# EAGLE design detcord-mdrv (EAGLE 7.6.0)
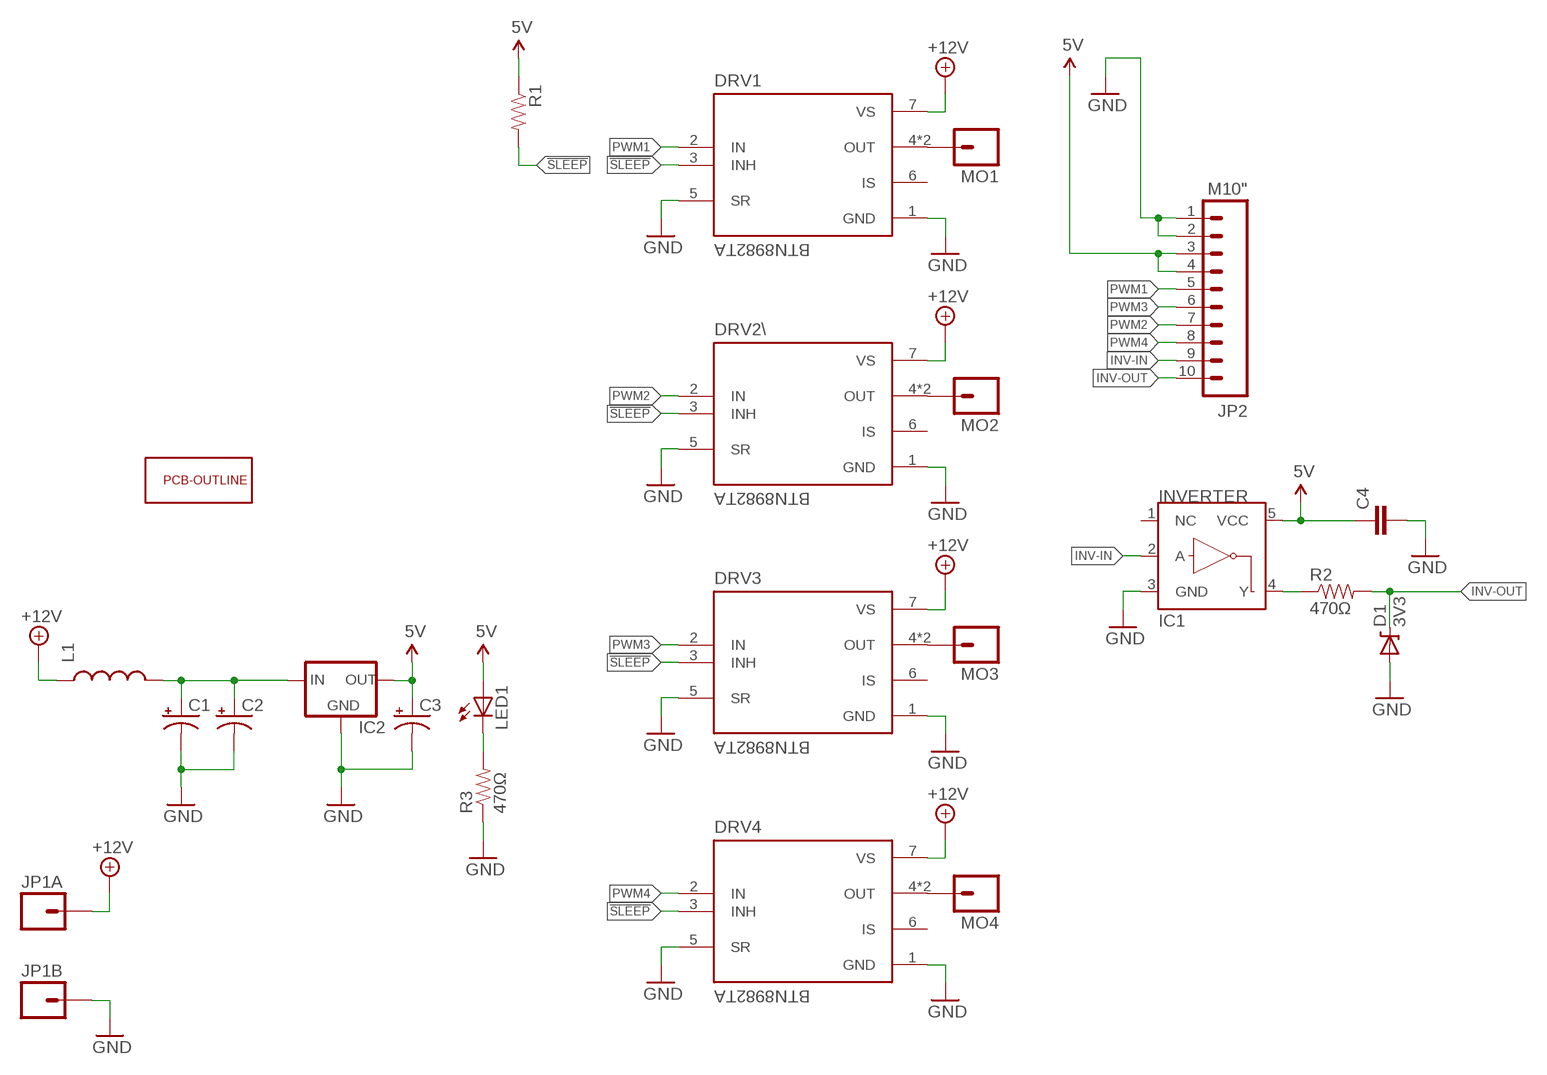
[diagram p0: schematic, sheet 1]

## Parts
C1  CAP_POLD  [PANASONIC_D]
C2  CAP_POLD  [PANASONIC_D]
C3  CAP_POLD  [PANASONIC_D]
C4  CAP0603-CAP  [0603-CAP]
D1  3V3  DIODE-ZENER-BZT52  [SOD-323]
DRV1  BTN8982TA  [DPAK127P1500X440-8N]
DRV2\  BTN8982TA  [DPAK127P1500X440-8N]
DRV3  BTN8982TA  [DPAK127P1500X440-8N]
DRV4  BTN8982TA  [DPAK127P1500X440-8N]
IC1  INVERTER  INVERTER""  [SC70]
IC2  V_REG_78XXSINK  [TO220-IGO]
JP1A  M01PTH_2MM  [1X01_2MM]
JP1B  M01PTH_2MM  [1X01_2MM]
JP2  M10"  [1X10]
L1  INDUCTORCR54  [CR54]
LED1  LED0603  [LED-0603]
MO1  M01PTH_2MM  [1X01_2MM]
MO2  M01PTH_2MM  [1X01_2MM]
MO3  M01PTH_2MM  [1X01_2MM]
MO4  M01PTH_2MM  [1X01_2MM]
PCBOUTLINE1  PCB-OUTLINE-38X24MM  [PCB-OUTLINE-38X24MM]
R1  RESISTOR0603-RES  [0603-RES]
R2  470Ω  RESISTOR0603-RES  [0603-RES]
R3  470Ω  RESISTOR0603-RES  [0603-RES]

## Nets
5V: C3.+ C4.1 IC1.5(VCC) IC2.OUT JP2.3 JP2.4 LED1.A R1.1
!SLEEP: DRV1.3(INH) DRV2\.3(INH) DRV3.3(INH) DRV4.3(INH) R1.2
+12V: DRV1.7(VS) DRV2\.7(VS) DRV3.7(VS) DRV4.7(VS) JP1A.1 L1.P$1
GND: C1.- C2.- C3.- C4.2 D1.2(A) DRV1.1(GND) DRV1.5(SR) DRV2\.1(GND) DRV2\.5(SR) DRV3.1(GND) DRV3.5(SR) DRV4.1(GND) DRV4.5(SR) IC1.3(GND) IC2.GND JP1B.1 JP2.1 JP2.2 R3.1
INV-IN: IC1.2(A) JP2.9
INV-OUT: D1.1(C) JP2.10 R2.2
N$1: C1.+ C2.+ IC2.IN L1.P$2
N$2: DRV1.4(OUT) DRV1.8(OUT) MO1.1
N$3: DRV2\.4(OUT) DRV2\.8(OUT) MO2.1
N$4: DRV3.4(OUT) DRV3.8(OUT) MO3.1
N$5: DRV4.4(OUT) DRV4.8(OUT) MO4.1
N$6: IC1.4(Y) R2.1
N$7: LED1.C R3.2
PWM1: DRV1.2(IN) JP2.5
PWM2: DRV2\.2(IN) JP2.7
PWM3: DRV3.2(IN) JP2.6
PWM4: DRV4.2(IN) JP2.8
Unconnected: DRV1.6(IS) DRV2\.6(IS) DRV3.6(IS) DRV4.6(IS) IC1.1(NC)

## Library data of the parts
C1-C3 = detcord-elec:CAP_POL: Capacitor Polarized These are standard SMD and PTH capacitors. Normally 10uF, 47uF, and 100uF in electrolytic and tantalum varieties. Always verify the external diameter of the through hole cap, it varies with capacity, voltage, and manufacturer. The EIA devices should be standard.
C4 = detcord-elec:CAP: Capacitor Standard 0603 ceramic capacitor, and 0.1" leaded capacitor.
D1 = detcord-elec:DIODE-ZENER: Zener Diode Production Part - 8199 3.4V Zener Voltage
DRV1 DRV2\ DRV3 DRV4 = detcord-elec:BTN8982TA: Half Bridge Driver DC Motors, General Purpose DMOS PG-TO263-7 Check availability <https://pricing.snapeda.com/parts/BTN8982TA/Infineon%20Technologies/view-part?ref=eda>; AVAILABILITY: In Stock; DESCRIPTION: Motor / Motion / Ignition Controllers & Drivers TRILITH IC / NOVALITH IC; MF: Infineon Technologies; MP: BTN8982TA; PACKAGE: TO-263-8 Infineon Technologies; PRICE: None
IC1 = detcord-elec:INVERTER: Single inverter, SOT23-5
IC2 = detcord-elec:V_REG_78XX: Voltage Regulator Standard 7805 5V regulator. IGO (Input Ground Output). Spark Fun Electronics SKU : COM-00107
JP1A JP1B MO1-MO4 = detcord-elec:M01: Header 1 Standard 1-pin 0.1" header. Use with straight break away headers (SKU : PRT-00116), right angle break away headers (PRT-00553), swiss pins (PRT-00743), machine pins (PRT-00117), and female headers (PRT-00115).
JP2 = detcord-elec:M10: Header 10 Standard 10-pin 0.1" header. Use with straight break away headers (SKU : PRT-00116), right angle break away headers (PRT-00553), swiss pins (PRT-00743), machine pins (PRT-00117), and female headers (PRT-00115).
L1 = detcord-elec:INDUCTOR: Inductors Basic Inductor/Choke - 0603 and 1206. Footprints are not proven and vary greatly between part numbers.
LED1 = detcord-elec:LED: LEDs Standard schematic elements and footprints for 5mm, 3mm, 1206, and 0603 sized LEDs. 5mm - Spark Fun Electronics SKU : COM-00529 (and others)
PCBOUTLINE1 = detcord-elec:PCB-OUTLINE
R1-R3 = detcord-elec:RESISTOR: Resistor Basic schematic elements and footprints for 0603, 1206, and PTH resistors.

## Board
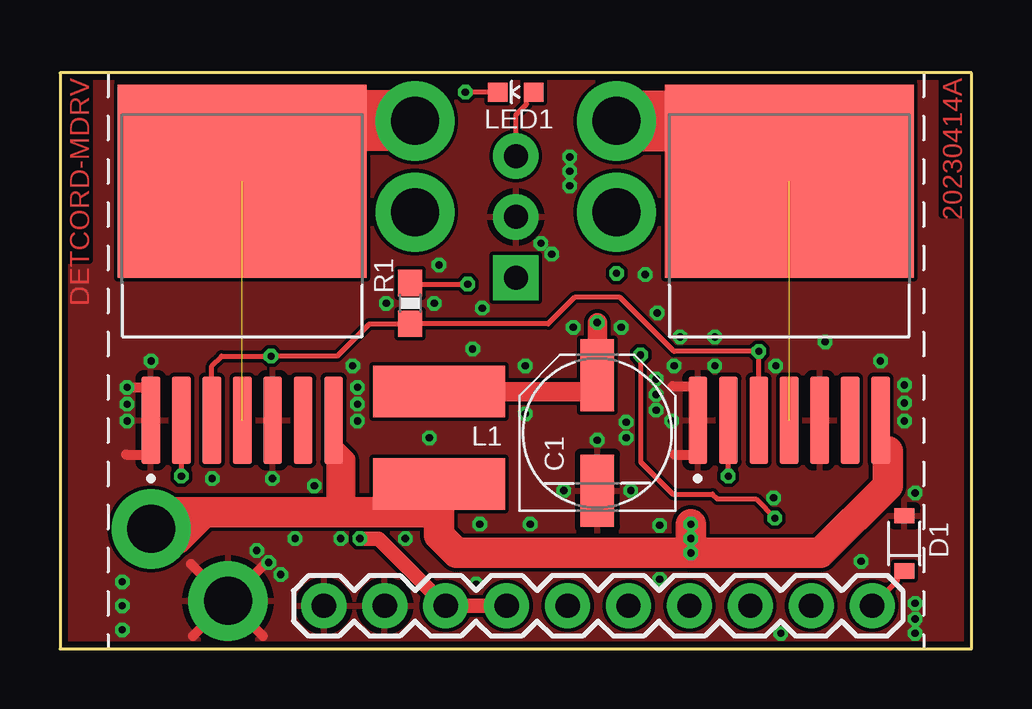
[diagram p1: board, top side]
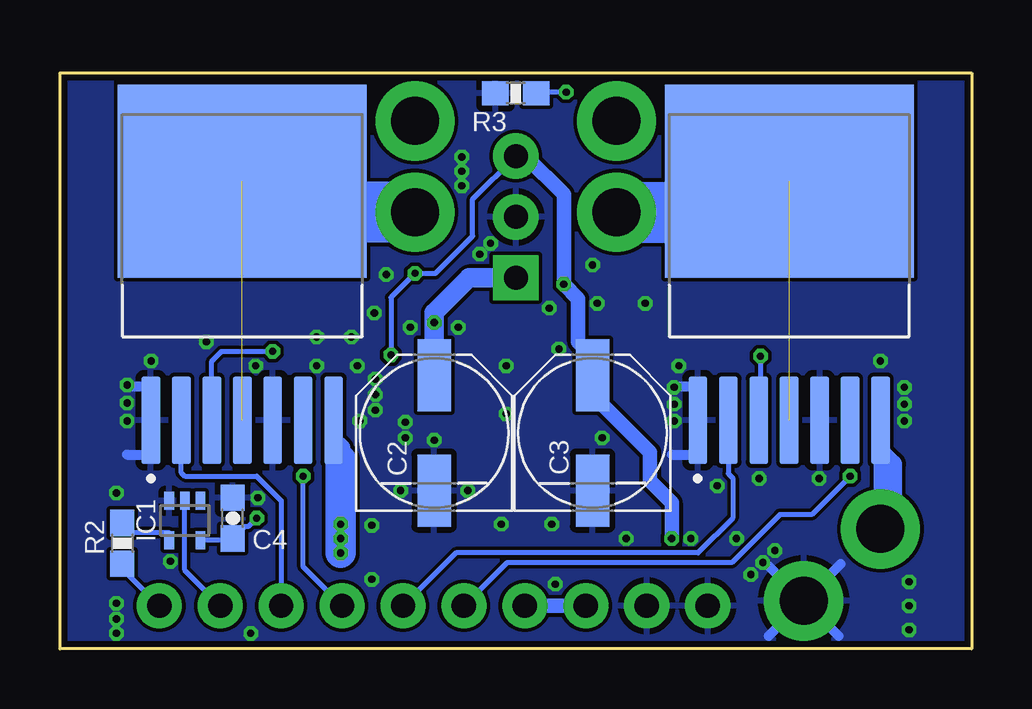
[diagram p2: board, bottom side, seen from below]

Size 38 x 24 mm. Coordinates in mm from the lower left corner, seen from the top.
Copper layers (1*16): Top 0.035mm / dielectric 1.5mm / Bottom 0.035mm
Design rules "fusion-eagle-rule-tentedvias": minimum track width 6mil, minimum drill 0.3mm, track to track 6mil, track to pad 6mil, pad to pad 6mil, via to via 6mil, smd to smd 0mil, copper to edge 10mil, drill to drill 10mil, minimum pad ring 10mil, minimum via ring 6mil, stop-mask expansion 2mil, vias tented up to drill 25mil, thermal gap 10mil

### Footprints (pad centres in the part's own frame; a part is rotated, then mirrored left to right if it is on the bottom)
PANASONIC_D = smd 3 x 1.4: + 2.4,0; - -2.4,0
0603-CAP = smd 1.1 x 1: 1 -0.85,0; 2 0.85,0
SOD-323 = smd 0.63 x 0.83: 1 -1.15,0; 2 1.15,0
DPAK127P1500X440-8N = smd 3.67 x 0.79: 1 -6.07,3.81; 2 -6.07,2.54; 3 -6.07,1.27; 4 -6.07,0; 5 -6.07,-1.27; 6 -6.07,-2.54; 7 -6.07,-3.81 | smd 8.04 x 10.37: 8 3.89,0
SC70 = smd 0.4 x 0.75: 1 -0.65,-0.825; 2 0,-0.825; 3 0.65,-0.825; 4 0.65,0.825; 5 -0.65,0.825
TO220-IGO = drill 1 pad 1.88: GND 0,0; OUT 2.54,0 | drill 1 pad 1.88 square: IN -2.54,0
1X01_2MM = drill 2 pad 3.302: 1 0,0
1X10 = drill 1.016 pad 1.88: 1 0,0; 2 2.54,0; 3 5.08,0; 4 7.62,0; 5 10.16,0; 6 12.7,0; 7 15.24,0; 8 17.78,0; 9 20.32,0; 10 22.86,0
CR54 = smd 5.5 x 2.15: P$1 0,1.92; P$2 0,-1.92
LED-0603 = smd 0.8 x 0.8: A 0,-0.75; C 0,0.75
0603-RES = smd 1.1 x 1: 1 -0.85,0; 2 0.85,0

### Placement (x,y rotation side)
C1  22.4,9 90 top
C2  22.4,9 90 bottom
C3  15.8,9 90 bottom
C4  30.8,5.45 90 bottom
D1  35.2,4.4 90 top
DRV1  7.6,15.6 90 top
DRV2\  30.4,15.6 90 top
DRV3  7.6,15.6 90 bottom
DRV4  30.4,15.6 90 bottom
IC1  32.8,5.35 180 bottom
IC2  19,18 90 top
JP1A  3.8,5 0 top
JP1B  7,2 0 top
JP2  11,1.8 0 top
L1  15.8,8.8 180 top
LED1  19,23.2 90 top
MO1  14.8,22 0 top
MO2  23.2,22 0 top
MO3  14.8,18.2 0 top
MO4  23.2,18.2 0 top
PCBOUTLINE1  0,0 0 top
R1  14.6,14.4 270 top
R2  35.4,4.4 270 bottom
R3  19,23.15 0 bottom

### Tracks (layer width: path | path; a pad name or v marks a point on that pad's centre or on a via)
5V  (via drill 0.3)
  Top 0.203: R1.1 14.6,15.2 v17,15.2 | v24.2,12.25 24.2,7.8 25.55,6.45 27.2,6.45 27.4,6.25 29,6.25 v29.8,5.45 | IC2.OUT 19,22.25 19.45,22.7 19.45,22.9 LED1.A
  Top 0.61: v12.5,4.6 13.28,4.6 JP2.3 18.6,1.8
  Bottom 0.203: IC2.OUT 20.8,18.74 20.8,17.2 22.35,15.65 v23.2,15.65 24.2,14.65 v24.2,12.25 | v29.8,5.45 30.15,5.1 30.3,5.1 C4.1 30.8,4.53 IC1.5
  Bottom 0.61: JP2.4 JP2.3 | v12.5,4.6 12.5,6.1 13.4,7 13.4,8.2 15.8,10.6 C3.+ 15.8,12.2 16.4,12.8 16.4,14.6 v17,15.2 17,18.95 18.59,20.54 IC2.OUT 18.75,20.54
!SLEEP  (via drill 0.3)
  Top 0.203: DRV1.3 6.33,11.79 6.74,12.2 v8.8,12.2 11.55,12.2 12.9,13.55 R1.2 20.35,13.55 21.45,14.65 23.35,14.65 25.6,12.4 v29.13,12.4 DRV2\.3
  Bottom 0.203: v8.8,12.2 8.8,9.53 DRV3.3 | DRV4.3 31.67,11.99 31.26,12.4 v29.13,12.4
+12V  (via drill 0.3)
  Top 0.61: DRV1.7 11.41,5.8 9.8,5.7 | 11.61,8.33 12,7.93 12,7.4 12.01,5.8 | 34.2,9.73 DRV2\.7 34.2,8.3 34.5,8.24
  Top 0.813: 12.01,5.8 11.91,5.7 11.8,5.7
  Top 1.27: L1.P$1 15.8,5.7 | 15.8,5.7 11.8,5.7 9.8,5.7 6,5.7 | 6,5.7 4.5,5.7 JP1A.1 | v26.3,4 31.7,4 34.5,6.8 34.5,8.24 | v26.3,4 16.54,4 15.8,4.74 15.8,5.7 | v26.3,4 v26.3,5.2 | 4.4,4.6 4.9,4.6 6,5.7
  Bottom 0.61: JP1A.1 DRV3.7 | DRV4.7 26.59,8.79 26.2,8.4 26.2,8
  Bottom 0.813: 26.2,8 26.3,7.9 | 3.7,8.1 3.3,7.7 3.3,5 JP1A.1
  Bottom 1.27: 26.3,7.9 v26.3,5.2 v26.3,4.6 v26.3,4
GND  (via drill 0.3)
  Top 0.406: JP1B.1 5.45,3.55 | JP1B.1 8.65,3.65 | JP1B.1 5.55,0.55 | JP1B.1 8.45,0.55 | v2.8,10.9 3.8,10.9 | 2.75,8.1 3.75,8.1 | 25.55,10.95 26.55,10.95 | 25.6,8.1 26.6,8.1
  Bottom 0.406: JP1B.1 5.45,3.55 | JP1B.1 8.45,3.45 | JP1B.1 5.55,0.55 | JP1B.1 8.45,0.55 | 35.25,10.95 34.25,10.95 | 35.2,8.1 34.2,8.1 | 12.4,10.95 11.4,10.95 | 12.5,8.1 11.5,8.1
  other vias: 9.8,4.6 8.85,7.1 14.4,4.6 9.2,3.1 8.7,3.6 8.2,4.1 2.8,9.5 3.8,12 12.4,9.5 12.2,11.8 22.4,8.7 21,6.6 23.8,6.6 17.5,5.2 17.2,12.5 13.6,14.4 15.6,14.4 21.4,13.4 23.4,13.4 24.9,14 25.6,11.8 25.5,9.5 34.2,12 35.2,9.5 35.65,6.5 29.75,6.3 6.35,7.1 11.7,4.6 24.85,11.25 24.85,10.6 24.85,9.95 23.6,9.45 23.6,8.8 17.6,14.2 15.8,16 15.4,8.8 19.6,5.2 35.2,11 24.4,15.6 19.4,11.8 19.4,9.8 27.3,11.8 27.3,13 25.85,13 35.65,0.65 35.65,1.25 35.65,1.9 33.4,3.65 30.05,0.65 29.84,11.8 31.9,12.8 21.25,19.3 21.25,19.9 21.25,20.5 20.5,16.45 20.05,16.9 10.6,6.8 2.6,2.8 2.6,0.8 2.6,1.8 25,2.9 25,5.15 17.35,2.7 2.8,10.2 12.4,10.2 12.4,10.9 35.2,10.25
  pour Bottom: 0,0 38,0 38,24 0,24
  pour Top: 0,0 38,0 38,24 0,24
INV-IN
  Bottom 0.203: JP2.9 32.8,3.28 IC1.2
INV-OUT
  Top 0.203: D1.1 35.2,3.14 34.9,3.14 34.9,2.84 JP2.10
  Bottom 0.203: R2.2 35.4,3.34 JP2.10
N$1  (via drill 0.3)
  Top 0.813: L1.P$2 22.4,10.72 C2.+ v22.4,13.6
  Bottom 0.813: IC2.IN 20.94,15.46 22.4,14 v22.4,13.6 C2.+
N$2  (1 unrouted)
  Top 2.54: MO1.1 7.6,22 DRV1.8
N$3  (1 unrouted)
  Top 2.54: MO2.1 30.4,22 DRV2\.8
N$4  (1 unrouted)
  Bottom 2.54: MO3.1 7.6,18.2 DRV3.8
N$5  (1 unrouted)
  Bottom 2.54: MO4.1 30.4,18.2 DRV4.8
N$6
  Bottom 0.203: IC1.4 33.45,4.85 35.4,4.85 R2.1
N$7  (via drill 0.3)
  Top 0.203: LED1.C v16.9,23.2
  Bottom 0.203: v16.9,23.2 18.1,23.2 R3.2
PWM1  (via drill 0.3)
  Top 0.203: DRV1.2 v5.06,7.2
  Bottom 0.203: v5.06,7.2 6.66,5.6 8,5.6 10,3.6 19.36,3.6 JP2.5
PWM2  (via drill 0.3)
  Top 0.203: v27.86,7.2 DRV2\.2
  Bottom 0.203: JP2.7 27.86,3.42 v27.86,7.2
PWM3
  Bottom 0.203: DRV3.2 10.14,7.31 9.95,7.12 9.95,5.45 11.4,4 21.5,4 JP2.6
PWM4
  Bottom 0.203: DRV4.2 32.94,7.34 32.8,7.2 29.8,7.2 28.78,6.18 JP2.8

### Text on the board
Top: DETCORD-MDRV | 20230414A